# Altium schematic sheet 13_SPI_Flash.SchDoc
size A4
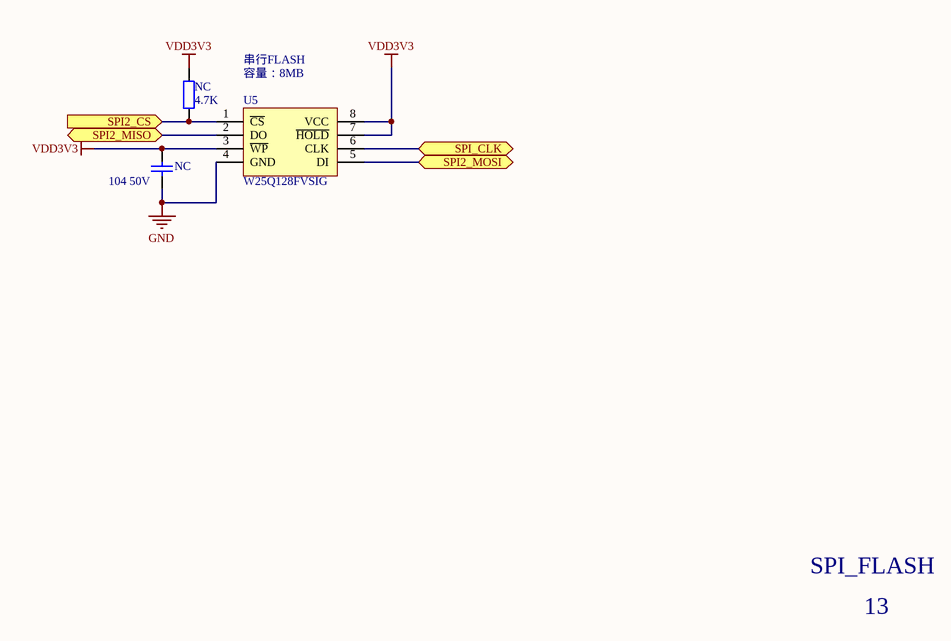
[diagram p0: 13_SPI_Flash.SchDoc]

## Parts
(Parts that share a designator on the sheet are numbered #1, #2 ... from top to bottom, then left to right.)
NC#1  4.7K  [SMD-0603]
NC#2  104 50V  [SMD-0603C]
U5  W25Q128FVSIG  [SO-8W]

## Ports
SPI2_CS (in), SPI2_MISO (bidir), SPI2_MOSI (bidir), SPI_CLK (bidir)

## Nets
GND: NC#2.2 U5.4(GND)
VDD3V3: NC#1.1 NC#2.1 U5.3(~{WP}) U5.7(~{HOLD}) U5.8(VCC)
SPI2_CS: NC#1.2 U5.1(~{CS}) ; port SPI2_CS
SPI2_MISO: U5.2(DO) ; port SPI2_MISO
SPI2_MOSI: U5.5(DI) ; port SPI2_MOSI
SPI_CLK: U5.6(CLK) ; port SPI_CLK

## Notes on the sheet
- 串行FLASH
- 容量：8MB
- SPI_FLASH
- 13

## Library data of the parts
NC#1 = RES2: 贴片电阻 5%
NC#2 = CAP4: 贴片电容 20%
U5 = W25Q128FV